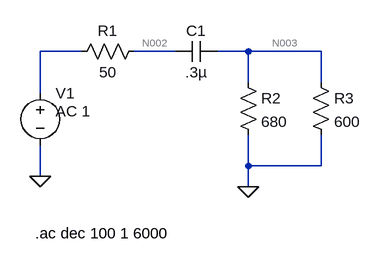
[diagram p0: schematic Design.asc]
Design.asc, the LTspice schematic file:
Version 4.1
SHEET 1 880 680
WIRE 128 48 64 48
WIRE 272 48 208 48
WIRE 384 48 336 48
WIRE 496 48 384 48
WIRE 384 96 384 48
WIRE 496 96 496 48
WIRE 64 112 64 48
WIRE 384 224 384 176
WIRE 496 224 496 176
WIRE 496 224 384 224
WIRE 64 240 64 192
WIRE 384 256 384 224
FLAG 64 240 0
FLAG 384 256 0
SYMBOL voltage 64 96 R0
WINDOW 123 24 44 Left 2
WINDOW 39 24 72 Left 2
SYMATTR Value2 AC 1
SYMATTR InstName V1
SYMATTR Value ""
SYMBOL cap 336 32 R90
WINDOW 0 0 32 VBottom 2
WINDOW 3 32 32 VTop 2
SYMATTR InstName C1
SYMATTR Value .3µ
SYMBOL res 368 80 R0
SYMATTR InstName R2
SYMATTR Value 680
SYMBOL res 480 80 R0
SYMATTR InstName R3
SYMATTR Value 600
SYMBOL res 224 32 R90
WINDOW 0 0 56 VBottom 2
WINDOW 3 32 56 VTop 2
SYMATTR InstName R1
SYMATTR Value 50
TEXT 56 328 Left 2 !.ac dec 100 1 6000

The netlist it stands for:
* Design.asc
V1 N001 0 AC 1
C1 N003 N002 .3µ
R2 N003 0 680
R3 N003 0 600
R1 N002 N001 50
.ac dec 100 1 6000
.backanno
.end

* Results of the author's LTspice run, read from the files saved beside the schematic
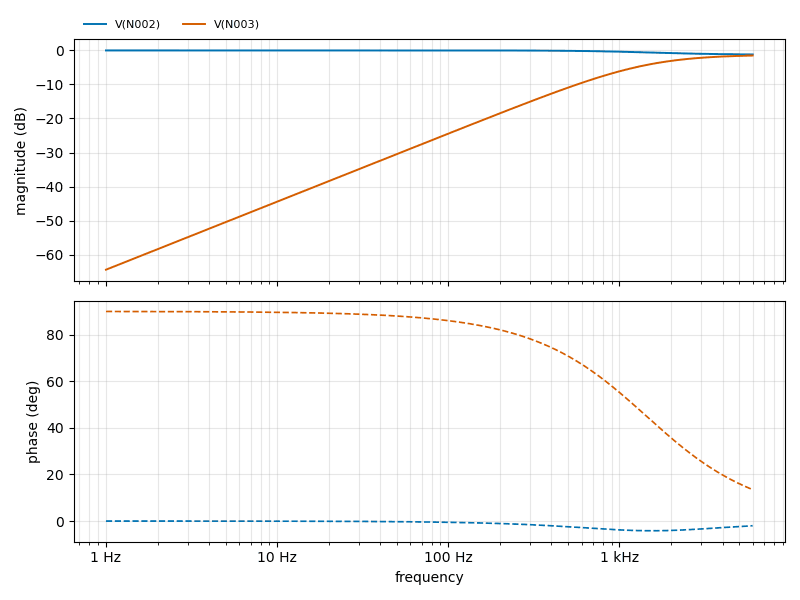
[diagram p1: AC Analysis of Design.asc, plotted from the saved traces]
* AC Analysis, 1 run:
*   V(N002): -0.00 dB at 1 Hz, -1.19 dB at 6 kHz, peak -0.00 dB at 1 Hz
*   V(N003): -64.42 dB at 1 Hz, -1.51 dB at 6 kHz, peak -1.51 dB at 6 kHz, 3 dB below the peak at 1.363 kHz